# EAGLE design pclone2_panel (EAGLE 6.6.0)
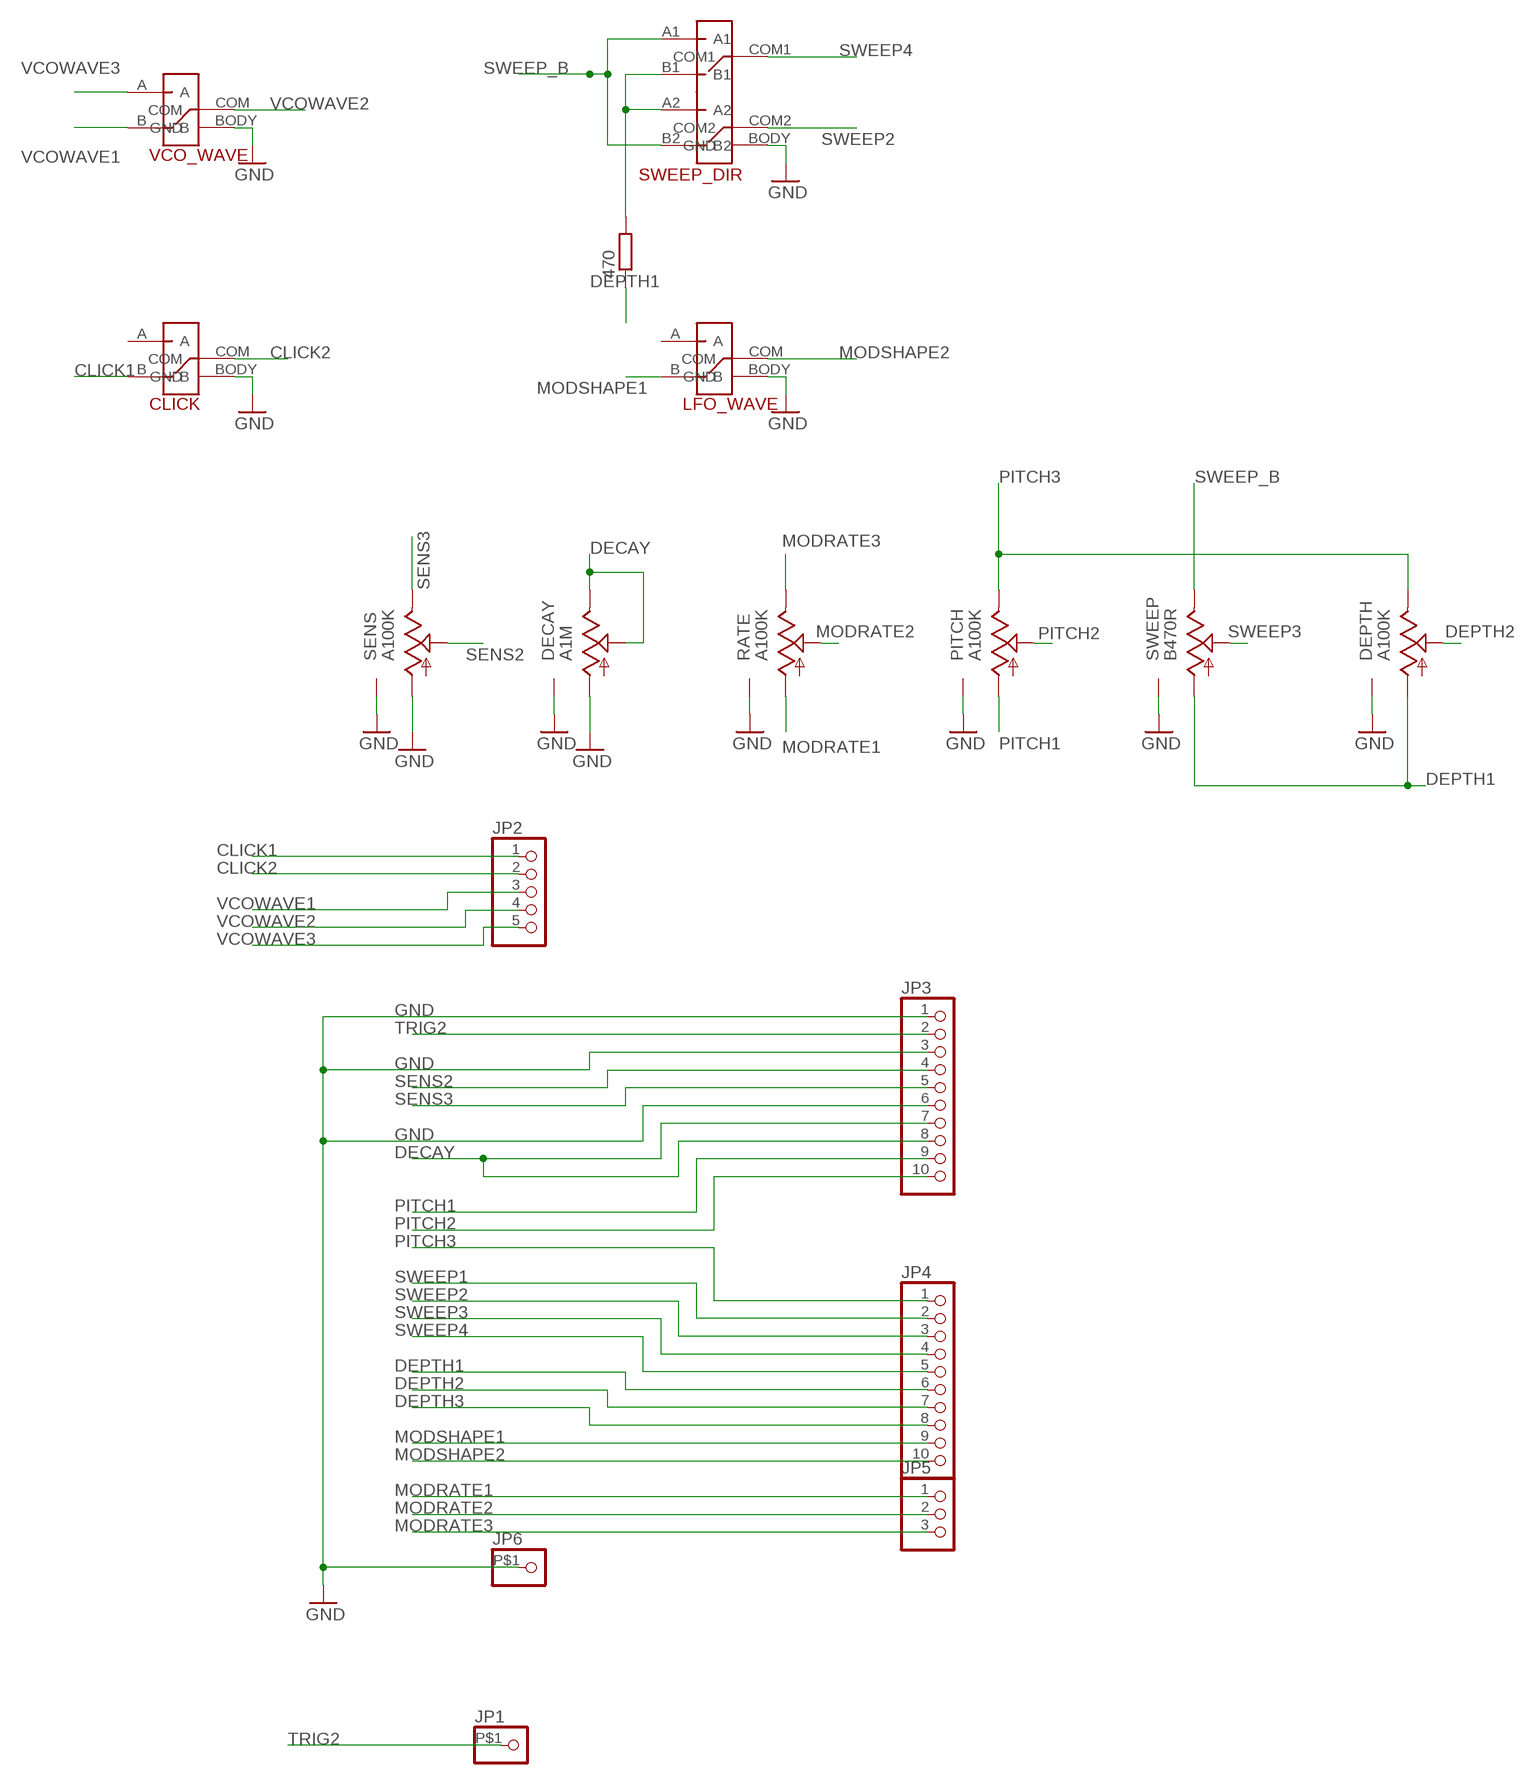
[diagram p0: schematic, sheet 1]

## Parts
470  R-EU_R0805  [R0805]
CLICK  SPD_SMTD  [SPDT_SMTD]
DECAY  A1M  16MM_POT_SMTD  [16MM_POT_SMTD]
DEPTH  A100K  16MM_POT_SMTD  [16MM_POT_SMTD]
JP1  PINHD-1X1SMT  [PINHEADPAD]
JP2  HEADER-1X5SMT  [1X05_SMT]
JP3  HEADER-1X10SMT  [1X10_SMT]
JP4  HEADER-1X10SMT  [1X10_SMT]
JP5  HEADER-1X3SMT  [1X03_SMT]
JP6  PINHD-1X1SMT  [PINHEADPAD]
LFO_WAVE  SPD_SMTD  [SPDT_SMTD]
PITCH  A100K  16MM_POT_SMTD  [16MM_POT_SMTD]
RATE  A100K  16MM_POT_SMTD  [16MM_POT_SMTD]
SENS  A100K  16MM_POT_SMTD  [16MM_POT_SMTD]
SWEEP  B470R  16MM_POT_SMTD  [16MM_POT_SMTD]
SWEEP_DIR  DPDT_SMTD  [DPDT_SMTD]
VCO_WAVE  SPD_SMTD  [SPDT_SMTD]

## Nets
CLICK1: CLICK.B JP2.1
CLICK2: CLICK.COM JP2.2
DECAY: DECAY.B DECAY.W JP3.7 JP3.8
DEPTH1: 470.1 DEPTH.A JP4.6 SWEEP.A
DEPTH2: DEPTH.W JP4.7
DEPTH3: JP4.8
GND: CLICK.BODY(GND) DECAY.A DECAY.BODY(GND) DEPTH.BODY(GND) JP3.1 JP3.3 JP3.6 JP6.P$1 LFO_WAVE.BODY(GND) PITCH.BODY(GND) RATE.BODY(GND) SENS.A SENS.BODY(GND) SWEEP.BODY(GND) SWEEP_DIR.BODY(GND) VCO_WAVE.BODY(GND)
MODRATE1: JP5.1 RATE.A
MODRATE2: JP5.2 RATE.W
MODRATE3: JP5.3 RATE.B
MODSHAPE1: JP4.9 LFO_WAVE.B
MODSHAPE2: JP4.10 LFO_WAVE.COM
N$2: 470.2 SWEEP_DIR.A2 SWEEP_DIR.B1
PITCH1: JP3.9 PITCH.A
PITCH2: JP3.10 PITCH.W
PITCH3: DEPTH.B JP4.1 PITCH.B
SENS2: JP3.4 SENS.W
SENS3: JP3.5 SENS.B
SWEEP1: JP4.2
SWEEP2: JP4.3 SWEEP_DIR.COM2
SWEEP3: JP4.4 SWEEP.W
SWEEP4: JP4.5 SWEEP_DIR.COM1
SWEEP_B: SWEEP.B SWEEP_DIR.A1 SWEEP_DIR.B2
TRIG2: JP1.P$1 JP3.2
VCOWAVE1: JP2.3 VCO_WAVE.B
VCOWAVE2: JP2.4 VCO_WAVE.COM
VCOWAVE3: JP2.5 VCO_WAVE.A
Unconnected: CLICK.A LFO_WAVE.A

## Library data of the parts
470 = rcl:R-EU_: RESISTOR, European symbol
CLICK LFO_WAVE VCO_WAVE = jason_eagle6:SPD_SMTD
DECAY DEPTH PITCH RATE SENS SWEEP = jason_eagle6:16MM_POT_SMTD
JP1 JP6 = jason_eagle6:PINHD-1X1: PIN HEADER
JP2 = microbuilder:HEADER-1X5: PIN HEADER
JP3 JP4 = microbuilder:HEADER-1X10: PIN HEADER
JP5 = microbuilder:HEADER-1X3: PIN HEADER
SWEEP_DIR = jason_eagle6:DPDT_SMTD

## Board
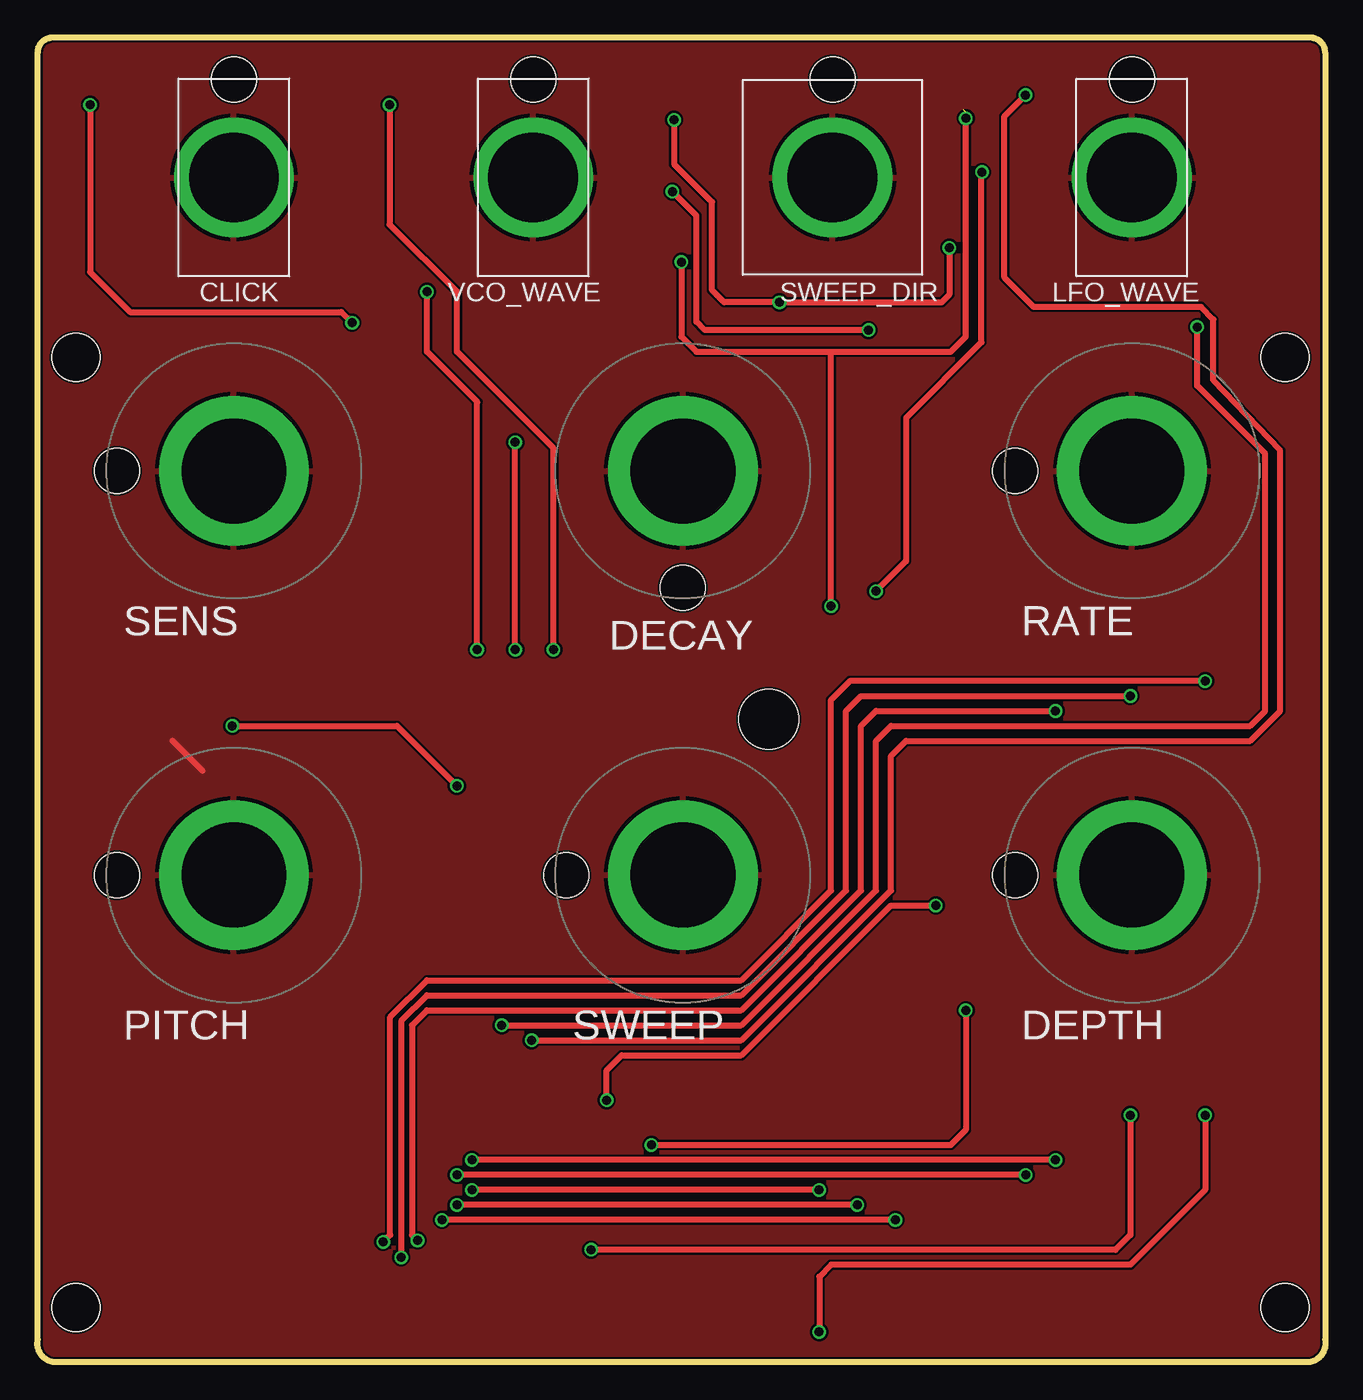
[diagram p1: board, top side]
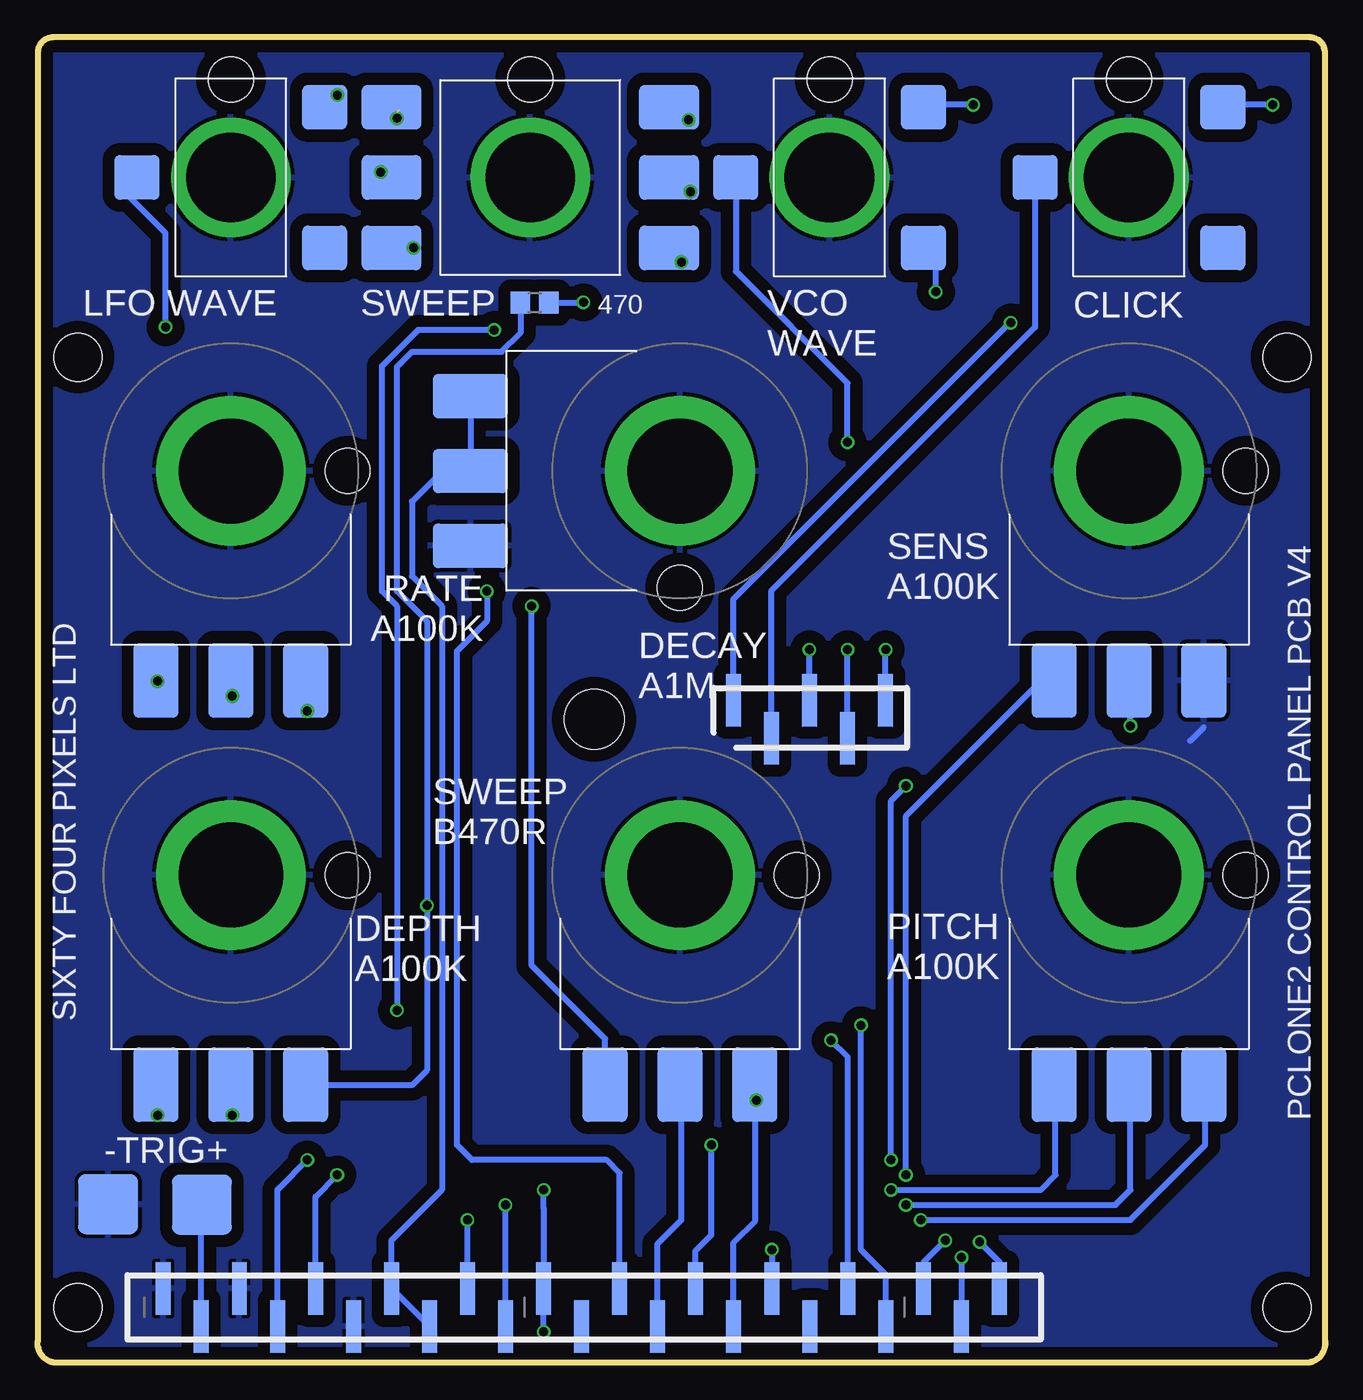
[diagram p2: board, bottom side, seen from below]

Size 86.05 x 88.5 mm. Coordinates in mm from the lower left corner, seen from the top.
Outline: 1.02,88.5 85.02,88.5 arc-90 86.02,87.5 86.02,1.5 arc-90 85.02,0 1.02,0 arc-90 0.02,1.5 0.02,87.5 arc-90 1.02,88.5
Copper layers (1*16): Top 0.035mm / dielectric 1.5mm / Bottom 0.035mm
Design rules "hackvana": minimum track width 6mil, minimum drill 0.3mm, track to track 6mil, track to pad 9mil, pad to pad 6mil, via to via 6mil, smd to smd 0mil, copper to edge 6mil, drill to drill 6mil, minimum pad ring 10mil, minimum via ring 6mil, stop-mask expansion 2mil, vias tented up to drill 100mil, thermal gap 10mil
Holes 3.2 mm at 2.57,3.63 2.57,67.14 83.35,3.63 83.35,67.14
Holes 3 mm at 13.12,85.7 33.12,85.7 53.12,85.7 73.12,85.7
Holes 4 mm at 48.86,42.95

### Footprints (pad centres in the part's own frame; a part is rotated, then mirrored left to right if it is on the bottom)
R0805 = smd 1.3 x 1.5: 1 -0.95,0; 2 0.95,0
SPDT_SMTD = smd 3 x 3 bottom: A -4.7,6.27; B 4.7,6.27; COM 0,-6.27 | drill 6 pad 8: BODY 0,0
16MM_POT_SMTD = smd 3 x 5 bottom: A -5,-14; B 5,-14; W 0,-14 | drill 7 pad 10: BODY 0,0 | hole 3: -7.8,0
PINHEADPAD = smd 4 x 4: P$1 0,0
1X05_SMT = smd 1 x 3.5: 1 -5.08,1.27; 2 -2.54,-1.27; 3 0,1.27; 4 2.54,-1.27; 5 5.08,1.27
1X10_SMT = smd 1 x 3.5: 1 -11.43,1.27; 2 -8.89,-1.27; 3 -6.35,1.27; 4 -3.81,-1.27; 5 -1.27,1.27; 6 1.27,-1.27; 7 3.81,1.27; 8 6.35,-1.27; 9 8.89,1.27; 10 11.43,-1.27
1X03_SMT = smd 1 x 3.5: 1 -2.54,1.27; 2 0,-1.27; 3 2.54,1.27
DPDT_SMTD = smd 3 x 4 bottom: A1 -4.7,9.27; A2 -4.7,-9.27; B1 4.7,9.27; B2 4.7,-9.27; COM1 0,9.27; COM2 0,-9.27 | drill 6 pad 8: BODY 0,0

### Placement (x,y rotation side)
470  52.82,70.78 0 bottom
CLICK  13.12,79.14 90 top
DECAY  43.12,59.54 90 top
DEPTH  73.12,32.54 0 top
JP1  75.06,10.52 0 bottom
JP2  34.47,42.95 0 bottom
JP3  66.2,3.65 0 bottom
JP4  40.8,3.65 0 bottom
JP5  24.3,3.65 0 bottom
JP6  81.32,10.55 0 bottom
LFO_WAVE  73.12,79.14 90 top
PITCH  13.12,32.54 0 top
RATE  73.12,59.54 0 top
SENS  13.12,59.54 0 top
SWEEP  43.12,32.54 0 top
SWEEP_DIR  53.12,79.14 90 top
VCO_WAVE  33.12,79.14 90 top

### Tracks (layer width: path | path; a pad name or v marks a point on that pad's centre or on a via)
CLICK1  (via drill 0.6)
  Top 0.406: v3.52,84 3.52,72.82 6.18,70.16 20.3,70.16 v21.02,69.44
  Bottom 0.406: v21.02,69.44 21.02,69.5 39.55,50.97 JP2.1 | v3.52,84 6.7,84 CLICK.B
CLICK2
  Bottom 0.406: CLICK.COM 19.39,69.13 37.02,51.5 JP2.2
DECAY
  Bottom 0.406: DECAY.B DECAY.W | DECAY.W 57.12,58.6 57.02,58.5 56.02,59.5 57.09,59.5 DECAY.W | DECAY.W 57.16,59.5 59.02,59.5 61.02,57.5 61.02,52.5 59.02,50.5 59.02,11.5 62.39,8.13 JP3.7 JP3.8
DEPTH1  (via drill 0.6)
  Top 0.406: v38.02,17.5 38.02,19.5 39.02,20.5 47.02,20.5 57.02,30.5 v60.02,30.5
  Bottom 0.406: DEPTH.A 68.09,18.5 61.02,18.5 60.02,19.5 v60.02,30.5 60.02,49.5 62.02,51.5 62.02,66.5 61.02,67.5 55.02,67.5 53.77,68.75 470.1 54.05,70.5 | v38.02,17.5 38.12,17.6 SWEEP.A 38.12,9.4 39.53,7.99 39.53,7.98 JP4.6
DEPTH2  (via drill 0.6)
  Top 0.406: v73.02,16.5 73.02,8.5 72.02,7.5 v36.99,7.5 v36.99,7.51
  Bottom 0.406: DEPTH.W 73.12,16.6 v73.02,16.5 | v36.99,7.51 JP4.7
GND
  Top 0.406: 9.02,41.5 11.02,39.5
  Bottom 0.406: 8.12,42.4 9.02,41.5
  pour Bottom (isolate 0.813): 0.02,88.5 86.02,88.5 86.07,-1.4 0.07,-1.4
  pour Top: -1.98,90.5 -1.98,-1.5 88.02,-1.5 88.02,90.5
MODRATE1  (via drill 0.6)
  Top 0.406: v68.02,43.5 56.02,43.5 55.02,42.5 55.02,31.5 47.02,23.5 26.02,23.5 25.02,22.5 25.02,8.5 v25.4,8.12
  Bottom 0.406: RATE.A 68.06,45.54 v68.02,43.5 | JP5.1 26.84,6.68 v25.4,8.12
MODRATE2  (via drill 0.6)
  Top 0.406: v73.02,44.5 55.02,44.5 54.02,43.5 54.02,31.5 47.02,24.5 26.02,24.5 24.3,22.78 v24.3,6.99
  Bottom 0.406: RATE.W 73.12,44.6 v73.02,44.5 | v24.3,6.99 JP5.2
MODRATE3  (via drill 0.6)
  Top 0.406: v78.02,45.5 54.27,45.5 53.02,44.25 53.02,31.5 47.02,25.5 26.02,25.5 23.57,23.05 23.57,8.5 v23.1,8.03
  Bottom 0.406: RATE.B 78.12,43.6 v78.02,45.5 | JP5.3 21.76,6.69 v23.1,8.03
MODSHAPE1  (via drill 0.6)
  Top 0.406: v33.02,21.5 47.02,21.5 57.02,31.5 57.02,40.5 58.02,41.5 81.02,41.5 83.02,43.5 83.02,60.88 78.57,65.59 78.57,69.65 77.73,70.5 66.55,70.5 64.6,72.45 64.6,83.25 v66.01,84.65
  Bottom 0.406: v33.02,21.5 31.91,20.39 JP4.9 | 67.02,83.67 LFO_WAVE.B 66.85,84.48 v66.01,84.65
MODSHAPE2  (via drill 0.6)
  Top 0.406: v31.02,22.5 47.02,22.5 56.02,31.5 56.02,41.5 57.02,42.5 81.02,42.5 82.02,43.5 82.02,60.69 77.48,65.23 v77.48,69.15
  Bottom 0.406: v31.02,22.5 31.02,7.5 29.37,5.85 JP4.10 | 80.02,79.5 79.75,79.5 LFO_WAVE.COM 79.02,78.77 79.84,77.95 79.84,77.78 77.48,75.42 v77.48,69.15
N$2  (via drill 0.6)
  Top 0.406: v60.92,74.45 60.92,71.3 60.42,70.8 v49.57,70.8 45.87,70.8 45.07,71.6 45.07,77.5 42.53,80.04 v42.53,82.99
  Bottom 0.406: 470.2 49.59,70.78 v49.57,70.8 | SWEEP_DIR.B1 43.38,83.84 v42.53,82.99 | v60.92,74.45 62.72,73.8 63.02,73.5 63.02,73.81 SWEEP_DIR.A2 61.75,73.8 v60.92,74.45
PITCH1  (via drill 0.6)
  Top 0.406: v57.32,9.5 v27.02,9.5
  Bottom 0.406: v57.32,9.5 57.31,8.21 JP3.9 | v27.02,9.5 13.02,9.5 8.02,14.5 8.02,18.44 PITCH.A
PITCH2  (via drill 0.6)
  Top 0.406: v54.77,10.5 v28.02,10.5
  Bottom 0.406: v28.02,10.5 14.02,10.5 13.02,11.5 13.02,18.44 PITCH.W | JP3.10 v54.77,10.5
PITCH3  (via drill 0.6)
  Top 0.406: v78.02,16.5 78.02,11.5 73.02,6.5 53.02,6.5 52.23,5.71 v52.23,2.01 | v52.22,11.5 v29.02,11.5
  Bottom 0.406: DEPTH.B 78.12,16.6 v78.02,16.5 | v52.22,11.5 52.23,10.29 JP4.1 v52.23,2.01 | v29.02,11.5 19.02,11.5 18.02,12.5 18.02,18.44 PITCH.B
SENS2  (via drill 0.6)
  Top 0.406: v68.02,13.5 v29.02,13.5 | v13.02,42.5 24.02,42.5 v28.02,38.5
  Bottom 0.406: v68.02,13.5 69.9,11.62 70.01,11.51 JP3.4 | v29.02,13.5 29.02,37.5 v28.02,38.5 | v13.02,42.5 13.02,45.44 SENS.W
SENS3  (via drill 0.6)
  Top 0.406: v66.02,12.5 v28.02,12.5
  Bottom 0.406: v66.02,12.5 67.47,11.05 JP3.5 | v28.02,12.5 28.02,36.5 19.02,45.5 18.16,45.5 SENS.B
SWEEP2  (via drill 0.6)
  Top 0.406: v56.02,51.5 58.02,53.5 58.02,63.07 63.08,68.13 63.08,79.48 v63.11,79.51
  Bottom 0.406: SWEEP_DIR.COM2 63.38,79.14 v63.11,79.51 | v56.02,51.5 56.02,49.5 58.02,47.5 58.02,14.5 57.02,13.5 48.02,13.5 47.15,12.62 JP4.3
SWEEP3
  Bottom 0.406: SWEEP.W 43.02,18.44 43.02,9.5 44.61,7.91 44.61,7.9 JP4.4
SWEEP4  (via drill 0.6)
  Top 0.406: v41.02,14.5 61.02,14.5 62.02,15.5 v62.02,23.5 | v55.52,68.95 44.57,68.95 44.02,69.5 44.02,76.6 v42.42,78.2
  Bottom 0.406: v41.02,14.5 41.02,8.5 42.07,7.45 JP4.5 | v62.02,23.5 62.02,50.5 63.02,51.5 63.02,66.55 60.62,68.95 v55.52,68.95 | SWEEP_DIR.COM1 44.38,79.14 v42.42,78.2
SWEEP_B  (via drill 0.6)  (1 unrouted)
  Top 0.406: v53.02,50.5 53.02,67.5 | 53.02,67.5 44.02,67.5 43.02,68.5 v43.02,73.5 | 53.02,67.5 61.02,67.5 62.02,68.5 v62.02,83.1
  Bottom 0.406: SWEEP.B 48.12,21.6 53.02,26.5 v53.02,50.5 | SWEEP_DIR.B2 62.02,83.84 61.85,83.67 | SWEEP_DIR.A1 44.08,74.44 v43.02,73.5 | v62.02,83.1 62.02,83.5
TRIG2
  Bottom 0.406: JP3.2 75.09,10.48 JP1.P$1
VCOWAVE1  (via drill 0.6)
  Top 0.406: v34.47,47.6 34.47,61.05 28.02,67.5 28.02,71.5 23.52,76 v23.52,84
  Bottom 0.406: 27.02,83.67 VCO_WAVE.B 27.01,84 | JP2.3 v34.47,47.6 | v23.52,84 27.01,84 | 27.52,84 27.01,84
VCOWAVE2  (via drill 0.6)
  Top 0.406: v31.93,61.44 v31.92,61.45 v31.92,47.6
  Bottom 0.406: v31.92,61.45 31.92,65.4 39.39,72.87 VCO_WAVE.COM | JP2.4 31.93,47.24 v31.92,47.6
VCOWAVE3  (via drill 0.6)
  Top 0.406: v26.02,71.5 26.02,67.5 29.39,64.13 29.37,64.11 v29.37,47.6
  Bottom 0.406: v26.02,71.5 26.02,74.5 26.8,74.5 VCO_WAVE.A | JP2.5 29.39,47.58 v29.37,47.6

### Text on the board
bPlace: CLICK | SWEEP | LFO WAVE | VCO / WAVE | PCLONE2 CONTROL PANEL PCB V4 | RATE / A100K | SENS / A100K | DECAY / A1M | SWEEP / B470R | PITCH / A100K | DEPTH / A100K | SIXTY FOUR PIXELS LTD | -TRIG+